# Altium schematic sheet Main.SchDoc
size A4
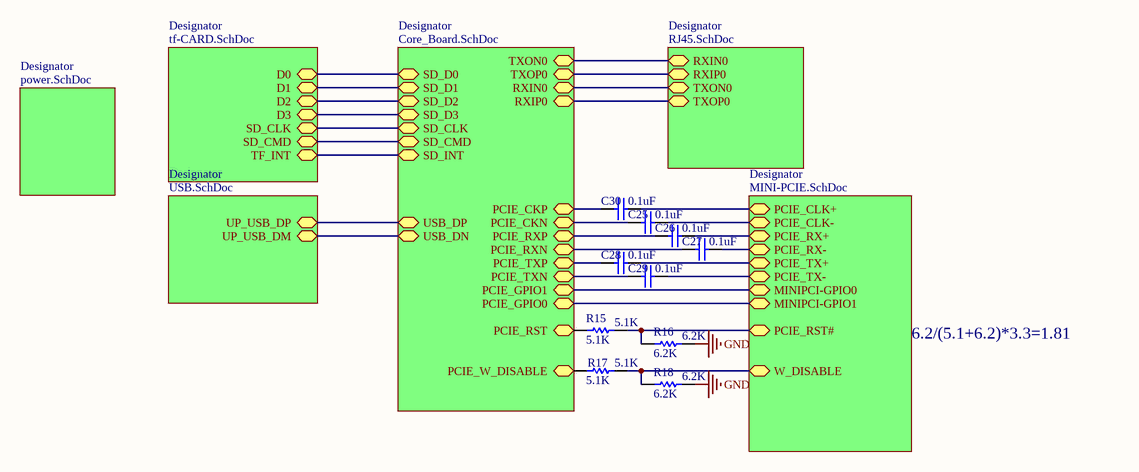
[diagram p0: Main.SchDoc]

## Parts
C25  value 0.1uF  [0402]  (hidden comment: Cap)
C26  value 0.1uF  [0402]  (hidden comment: Cap)
C27  value 0.1uF  [0402]  (hidden comment: Cap)
C28  value 0.1uF  [0402]  (hidden comment: Cap)
C29  value 0.1uF  [0402]  (hidden comment: Cap)
C30  value 0.1uF  [0402]  (hidden comment: Cap)
R15  5.1K  [0402]
R16  6.2K  [0402]
R17  5.1K  [0402]
R18  6.2K  [0402]

## Sub-sheets
Designator = Core_Board.SchDoc: SD_D0, SD_D1, SD_D2, SD_D3, SD_CLK, SD_CMD, USB_DN, USB_DP, RXIN0, RXIP0, TXON0, TXOP0, PCIE_CKN, PCIE_CKP, PCIE_RST, PCIE_RXN, PCIE_RXP, PCIE_TXP, PCIE_TXN, PCIE_GPIO1, PCIE_GPIO0, PCIE_W_DISABLE, SD_INT
Designator = power.SchDoc: no entries
Designator = tf-CARD.SchDoc: D0, D1, D2, D3, SD_CLK, SD_CMD, TF_INT
Designator = USB.SchDoc: UP_USB_DP, UP_USB_DM
Designator = RJ45.SchDoc: RXIN0, RXIP0, TXON0, TXOP0
Designator = MINI-PCIE.SchDoc: PCIE_CLK+, PCIE_CLK-, PCIE_RX+, PCIE_RX-, PCIE_TX+, PCIE_TX-, W_DISABLE, PCIE_RST#, MINIPCI-GPIO0, MINIPCI-GPIO1

## Nets
GND: R16.1 R18.2
NetC25_1: C25.1 ; sheet Designator/PCIE_CLK-
NetC25_2: C25.2 ; sheet Designator/PCIE_CKN
NetC26_1: C26.1 ; sheet Designator/PCIE_RX+
NetC26_2: C26.2 ; sheet Designator/PCIE_RXP
NetC27_1: C27.1 ; sheet Designator/PCIE_RX-
NetC27_2: C27.2 ; sheet Designator/PCIE_RXN
NetC28_1: C28.1 ; sheet Designator/PCIE_TX+
NetC28_2: C28.2 ; sheet Designator/PCIE_TXP
NetC29_1: C29.1 ; sheet Designator/PCIE_TX-
NetC29_2: C29.2 ; sheet Designator/PCIE_TXN
NetC30_1: C30.1 ; sheet Designator/PCIE_CLK+
NetC30_2: C30.2 ; sheet Designator/PCIE_CKP
NetR15_1: R15.1 ; sheet Designator/PCIE_RST
NetR15_2: R15.2 R16.2 ; sheet Designator/PCIE_RST#
NetR17_1: R17.1 ; sheet Designator/PCIE_W_DISABLE
NetR17_2: R17.2 R18.1 ; sheet Designator/W_DISABLE
(unnamed): sheet Designator/SD_D0, sheet Designator/D0
(unnamed): sheet Designator/SD_D1, sheet Designator/D1
(unnamed): sheet Designator/SD_D2, sheet Designator/D2
(unnamed): sheet Designator/SD_D3, sheet Designator/D3
(unnamed): sheet Designator/SD_CLK, sheet Designator/SD_CLK
(unnamed): sheet Designator/SD_CMD, sheet Designator/SD_CMD
(unnamed): sheet Designator/USB_DN, sheet Designator/UP_USB_DM
(unnamed): sheet Designator/USB_DP, sheet Designator/UP_USB_DP
(unnamed): sheet Designator/RXIN0, sheet Designator/TXON0
(unnamed): sheet Designator/RXIP0, sheet Designator/TXOP0
(unnamed): sheet Designator/TXON0, sheet Designator/RXIN0
(unnamed): sheet Designator/TXOP0, sheet Designator/RXIP0
(unnamed): sheet Designator/PCIE_GPIO1, sheet Designator/MINIPCI-GPIO0
(unnamed): sheet Designator/PCIE_GPIO0, sheet Designator/MINIPCI-GPIO1
(unnamed): sheet Designator/SD_INT, sheet Designator/TF_INT

## Notes on the sheet
- 6.2/(5.1+6.2)*3.3=1.81

## Library data of the parts
C25-C30 = Cap: Capacitor; Published: 8-Jun-2000; LatestRevisionDate: 17-Jul-2002; LatestRevisionNote: Re-released for DXP Platform.; PackageReference: RAD-0.3; Publisher: Altium Limited
R15-R18 = Res Semi: Semiconductor Resistor; Published: 8-Jun-2000; LatestRevisionDate: 17-Jul-2002; LatestRevisionNote: Re-released for DXP Platform.; PackageReference: AXIAL-0.5; Publisher: Altium Limited
  R15 R17: Value: 5.1K
  R16 R18: Value: 6.2K